# Altium schematic sheet LoRa_0.SchDoc: LoRa
size 282 x 212 mm; Origin: Eagle; Date: 2/14/2024 4:13:40 PM; SheetNumber: 1; GateName_1: G$1; SymbolName_1: A4L-LOC; LibraryName: frames; DeviceSetName: A4L-LOC; Sheet: Sheet:
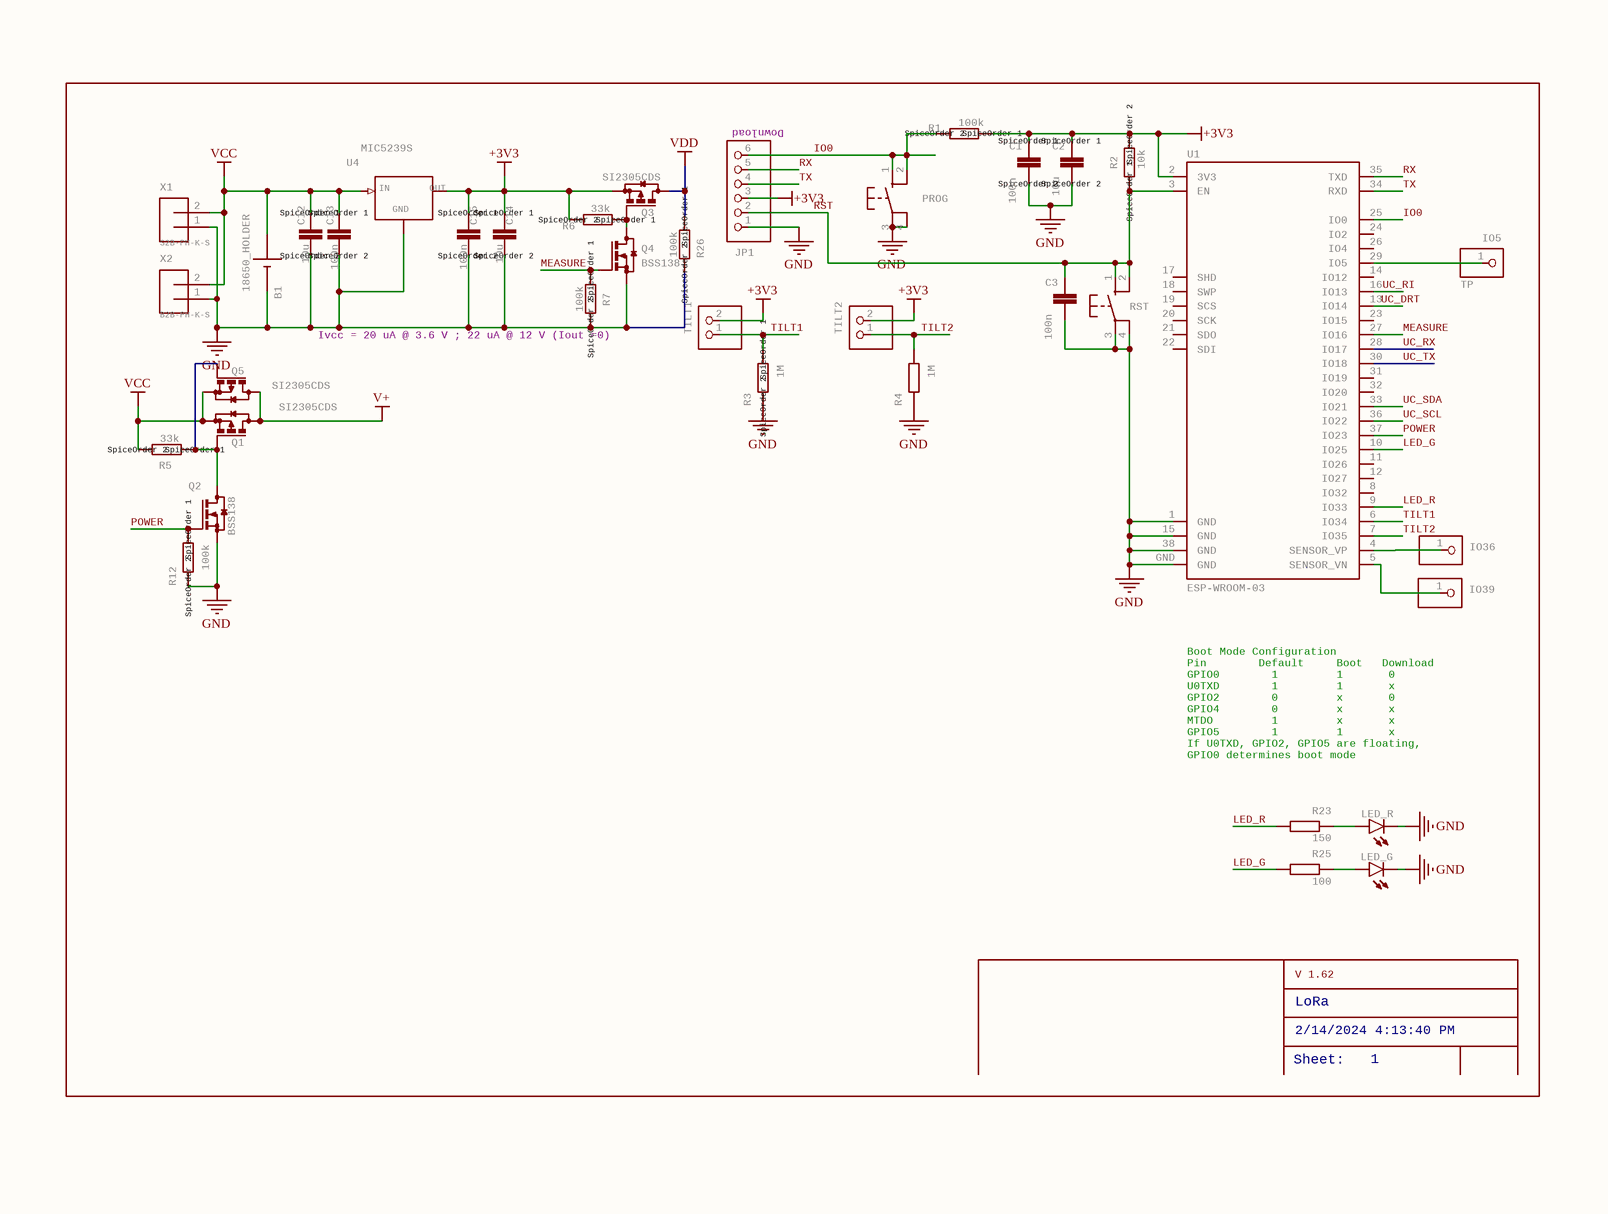
[diagram p0: LoRa_0.SchDoc]

## Parts
B1  18650_HOLDER  [18650]
C1  100n  SpiceOrder1: SpiceOrder 1  SpiceOrder2: SpiceOrder 2  [C1206]
C2  10u  SpiceOrder1: SpiceOrder 1  SpiceOrder2: SpiceOrder 2  [C1210]
C3  100n  [C1206]
C12  10u  SpiceOrder1: SpiceOrder 1  SpiceOrder2: SpiceOrder 2  [C1210]
C13  100n  SpiceOrder1: SpiceOrder 1  SpiceOrder2: SpiceOrder 2  [C1206]
C14  10u  SpiceOrder1: SpiceOrder 1  SpiceOrder2: SpiceOrder 2  [C1210]
C15  100n  SpiceOrder1: SpiceOrder 1  SpiceOrder2: SpiceOrder 2  [C1206]
IO5  TP  [1X01]
IO36  PINHD-1X1  [1X01]  (value not drawn)
IO39  PINHD-1X1  [1X01]  (value not drawn)
JP1  PINHD-1X6  [1X06]  (value not drawn)
LED_G  LEDSMT1206  [1206]  (value not drawn)
LED_R  LEDSMT1206  [1206]  (value not drawn)
PROG  10-XX  [B3F-10XX]  (value not drawn)
Q1  SI2305CDS  [SOT23]
Q2  BSS138  [SOT23]
Q3  SI2305CDS  [SOT23]
Q4  BSS138  [SOT23]
Q5  SI2305CDS  [SOT23]
R1  100k  SpiceOrder1: SpiceOrder 1  SpiceOrder2: SpiceOrder 2  [R1206]
R2  10k  SpiceOrder1: SpiceOrder 1  SpiceOrder2: SpiceOrder 2  [R1206]
R3  1M  SpiceOrder1: SpiceOrder 1  SpiceOrder2: SpiceOrder 2  [R1206]
R4  1M  [R1206]
R5  33k  SpiceOrder1: SpiceOrder 1  SpiceOrder2: SpiceOrder 2  [R1206]
R6  33k  SpiceOrder1: SpiceOrder 1  SpiceOrder2: SpiceOrder 2  [R1206]
R7  100k  SpiceOrder1: SpiceOrder 1  SpiceOrder2: SpiceOrder 2  [R1206]
R12  100k  SpiceOrder1: SpiceOrder 1  SpiceOrder2: SpiceOrder 2  [R1206]
R23  150  [R1206]
R25  100  [R1206]
R26  100k  SpiceOrder1: SpiceOrder 1  SpiceOrder2: SpiceOrder 2  [R1206]
RST  10-XX  [B3F-10XX]  (value not drawn)
TILT1  PINHD-1X2  [1X02]  (value not drawn)
TILT2  PINHD-1X2  [1X02]  (value not drawn)
U1  ESP-WROOM-03  [ESP-WROOM-03]
U4  MIC5239S  [SOT223]
X1  S2B-PH-K-S  [S2B-PH-K-S]
X2  B2B-PH-K-S  [B2B-PH-K-S]

## Nets
+3V3: C1.1 C2.1 C14.1 C15.1 JP1.3 Q3.2(S) R1.1 R2.2 R6.2 TILT1.2 TILT2.2 U1.2(3V3) U4.3(OUT)
GND: B1.- C1.2 C2.2 C3.2 C12.2 C13.2 C14.2 C15.2 JP1.1 LED_G.C LED_R.C PROG.3(P) PROG.4(P1) Q2.2(S) Q4.2(S) R3.2 R4.2 R7.2 R12.2 R26.2 RST.3(P) RST.4(P1) U1.1(GND) U1.15(GND) U1.38(GND) U1.GND U4.2,4(GND) X1.1 X2.1
V+: Q1.3(D) Q5.3(D)
VCC: B1.+ C12.1 C13.1 Q1.2(S) Q5.2(S) R5.2 U4.1(IN) X1.2 X2.2
VDD: Q3.3(D) R26.1
IO0: JP1.6 PROG.1(S) PROG.2(S1) R1.2 U1.25(IO0)
LED_G: R25.1 U1.10(IO25)
LED_R: R23.1 U1.9(IO33)
MEASURE: Q4.1(G) R7.1 U1.27(IO16)
POWER: Q2.1(G) R12.1 U1.37(IO23)
RST: C3.1 JP1.2 R2.1 RST.1(S) RST.2(S1) U1.3(EN)
RX: JP1.5 U1.35(TXD)
TILT1: R3.1 TILT1.1 U1.6(IO34)
TILT2: R4.1 TILT2.1 U1.7(IO35)
TX: JP1.4 U1.34(RXD)
UC_DRT: U1.13(IO14)
UC_RI: U1.16(IO13)
UC_RX: U1.28(IO17)
UC_SCL: U1.36(IO22)
UC_SDA: U1.33(IO21)
UC_TX: U1.30(IO18)
NetIO5_1: IO5.1 U1.29(IO5)
NetIO36_1: IO36.1 U1.4(SENSOR_VP)
NetIO39_1: IO39.1 U1.5(SENSOR_VN)
NetLED_G_A: LED_G.A R25.2
NetLED_R_A: LED_R.A R23.2
NetQ1_1: Q1.1(G) Q2.3(D) Q5.1(G) R5.1
NetQ3_1: Q3.1(G) Q4.3(D) R6.1

Not connected (* = marked no-connect by the designer): U1 8(IO32) 11(IO26) 12(IO27) 14(IO12) 17(SHD) 18(SWP) 19(SCS) 20(SCK) 21(SDO) 22(SDI) 23(IO15) 24(IO2) 26(IO4) 31(IO19) 32(IO20)

## Notes on the sheet
- (near JP1) Download
- (near R7) Ivcc = 20 uA @ 3.6 V ; 22 uA @ 12 V (Iout =0)
- Boot Mode Configuration
  Pin        Default     Boot   Download
  GPIO0        1         1       0
  U0TXD        1         1       x
  GPIO2        0         x       0
  GPIO4        0         x       x
  MTDO         1         x       x
  GPIO5        1         1       x
  If U0TXD, GPIO2, GPIO5 are floating,
  GPIO0 determines boot mode
- V 1.62
- LoRa
- Sheet:
- 2/14/2024 4:13:40 PM
- 1

## Library data of the parts
B1 = 18650_HOLDER: 18650 holder; GateName_1: G$1; SymbolName_1: 1V2; LibraryName: battery_bms; DeviceSetName: 18650_HOLDER
C1 C3 C13 C15 = CC1206: CAPACITOR, European symbol; GateName_1: G$1; SymbolName_1: C; DeviceName: C1206; LibraryName: eagle-ltspice; DeviceSetName: C; SPICEMODEL: NONE; SPICEPREFIX: C
C2 C12 C14 = CC1210: CAPACITOR, European symbol; GateName_1: G$1; SymbolName_1: C; DeviceName: C1210; LibraryName: eagle-ltspice; DeviceSetName: C; SPICEMODEL: NONE; SPICEPREFIX: C
IO5 IO36 IO39 = PINHD-1X1: PIN HEADER; GateName_1: G$1; SymbolName_1: PINHD1; POPULARITY: 64; LibraryName: pinhead; DeviceSetName: PINHD-1X1
JP1 = PINHD-1X6: PIN HEADER; GateName_1: A; SymbolName_1: PINHD6; POPULARITY: 79; LibraryName: pinhead; DeviceSetName: PINHD-1X6
LED_G LED_R = LEDSMT1206: LED   OSRAM: - CHIPLED LG R971, LG N971, LY N971, LG Q971, LY Q971, LO R971, LY R971 LH N974, LH R974 LS Q976, LO Q976, LY Q976 LO Q996 - Hyper CHIPLED LW Q18S LB Q993, LB Q99A, LB R99A - SideLED LS A670, LO A670, LY A670, LG A670, LP A670 LB A673, LV A673, LT A673, LW A673 LH A674 LY A675 LS A676, LA A676, LO A676, LY A676, LW A676 LS A679, LY A679, LG A679 -  Hyper Micro SIDELEDÂ® LS Y876, LA Y876, LO Y876, LY Y876 LT Y87S - SmartLED LW L88C, LW L88S LB L89C, LB L89S, LG L890 LS L89K, LO L89K, LY L89K LS L896, LA L896, LO L896, LY L896 - TOPLED LS T670, LO T670, LY T670, LG T670, LP T670 LSG T670, LSP T670, LSY T670, LOP T670, LYG T670 LG T671, LOG T671, LSG T671 LB T673, LV T673, LT T673, LW T673 LH T674 LS T676, LA T676, LO T676, LY T676, LB T676, LH T676, LSB T676, LW T676 LB T67C, LV T67C, LT T67C, LS T67K, LO T67K, LY T67K, LW E67C LS E67B, LA E67B, LO E67B, LY E67B, LB E67C, LV E67C, LT E67C LW T67C LS T679, LY T679, LG T679 LS T770, LO T770, LY T770, LG T770, LP T770 LB T773, LV T773, LT T773, LW T773 LH T774 LS E675, LA E675, LY E675, LS T675 LS T776, LA T776, LO T776, LY T776, LB T776 LHGB T686 LT T68C, LB T68C - Hyper Mini TOPLEDÂ® LB M676 - Mini TOPLED SantanaÂ® LG M470 LS M47K, LO M47K, LY M47K    Source: http://www.osram.convergy.de   LUXEON: - LUMILEDÂ® LXK2-PW12-R00, LXK2-PW12-S00, LXK2-PW14-U00, LXK2-PW14-V00 LXK2-PM12-R00, LXK2-PM12-S00, LXK2-PM14-U00 LXK2-PE12-Q00, LXK2-PE12-R00, LXK2-PE12-S00, LXK2-PE14-T00, LXK2-PE14-U00 LXK2-PB12-K00, LXK2-PB12-L00, LXK2-PB12-M00, LXK2-PB14-N00, LXK2-PB14-P00, LXK2-PB14-Q00 LXK2-PR12-L00, LXK2-PR12-M00, LXK2-PR14-Q00, LXK2-PR14-R00 LXK2-PD12-Q00, LXK2-PD12-R00, LXK2-PD12-S00 LXK2-PH12-R00, LXK2-PH12-S00 LXK2-PL12-P00, LXK2-PL12-Q00, LXK2-PL12-R00    Source: www.luxeon.com   KINGBRIGHT:   KA-3528ASYC Source: www.kingbright.com; GateName_1: G$1; POPULARITY: 20; SymbolName_1: LED; DeviceName: SMT1206; LibraryName: led; DeviceSetName: LED
PROG RST = 10-XX: OMRON SWITCH; MPN: B3F-1000; GateName_1: 1; SymbolName_1: TS2; POPULARITY: 72; LibraryName: switch-omron; DeviceSetName: 10-XX; MF: MF; OC_FARNELL: 176432; OC_NEWARK: 36M3542
Q1 Q3 Q5 = SI2305CDS: P-CHANNEL MOS FET; GateName_1: G$1; SymbolName_1: P-MOS; LibraryName: transistor-small-signal-perso; DeviceSetName: SI2305CDS
Q2 Q4 = BSS131: N-CHANNEL MOS FET; GateName_1: G$1; SymbolName_1: N-MOS; LibraryName: transistor-small-signal-perso; DeviceSetName: BSS131
R1-R7 R12 R23 R25 = RR1206: RESISTOR, European symbol; GateName_1: G$1; SymbolName_1: R; DeviceName: R1206; LibraryName: eagle-ltspice; DeviceSetName: R; SPICEMODEL: NONE; SPICEPREFIX: R
R26 = RR1206: RESISTOR, European symbol; GateName_1: G$1; SymbolName_1: R26; DeviceName: R1206; LibraryName: eagle-ltspice; DeviceSetName: R26; SPICEMODEL: NONE; SPICEPREFIX: R
TILT1 TILT2 = PINHD-1X2: PIN HEADER; GateName_1: G$1; SymbolName_1: PINHD2; POPULARITY: 98; LibraryName: pinhead; DeviceSetName: PINHD-1X2
U1 = ESP-WROOM-03: GateName_1: G$1; SymbolName_1: ESP-WROOM-03; LibraryName: esp32-sparkfun (1); DeviceSetName: ESP-WROOM-03; MF: MF; MPN: MPN; OC_FARNELL: unknown
U4 = MIC5239S: LDO REGULATOR; GateName_1: G$1; SymbolName_1: MIC5239S; LibraryName: micrel; DeviceSetName: MIC5239S; GND: GND; IN: IN; OUT: OUT
X1 = S2B-PH-K-S: JST PH series header 2.00mm pitch disconnectable crimp style connectors, horizontal (side entry type), 2 pins; GateName_1: G$1; SymbolName_1: M_1R02; DeviceName: -K-S; DeviceSetName: S2B-PH; LibraryName: con-JST PH
X2 = B2B-PH-K-S: JST PH series header 2.00mm pitch disconnectable crimp style connectors, vertical (side entry type), 2 pins; GateName_1: G$1; SymbolName_1: M_1R02; DeviceName: -K-S; DeviceSetName: B2B-PH; LibraryName: con-JST PH